# Altium schematic sheet 02-POWER.SchDoc
size C
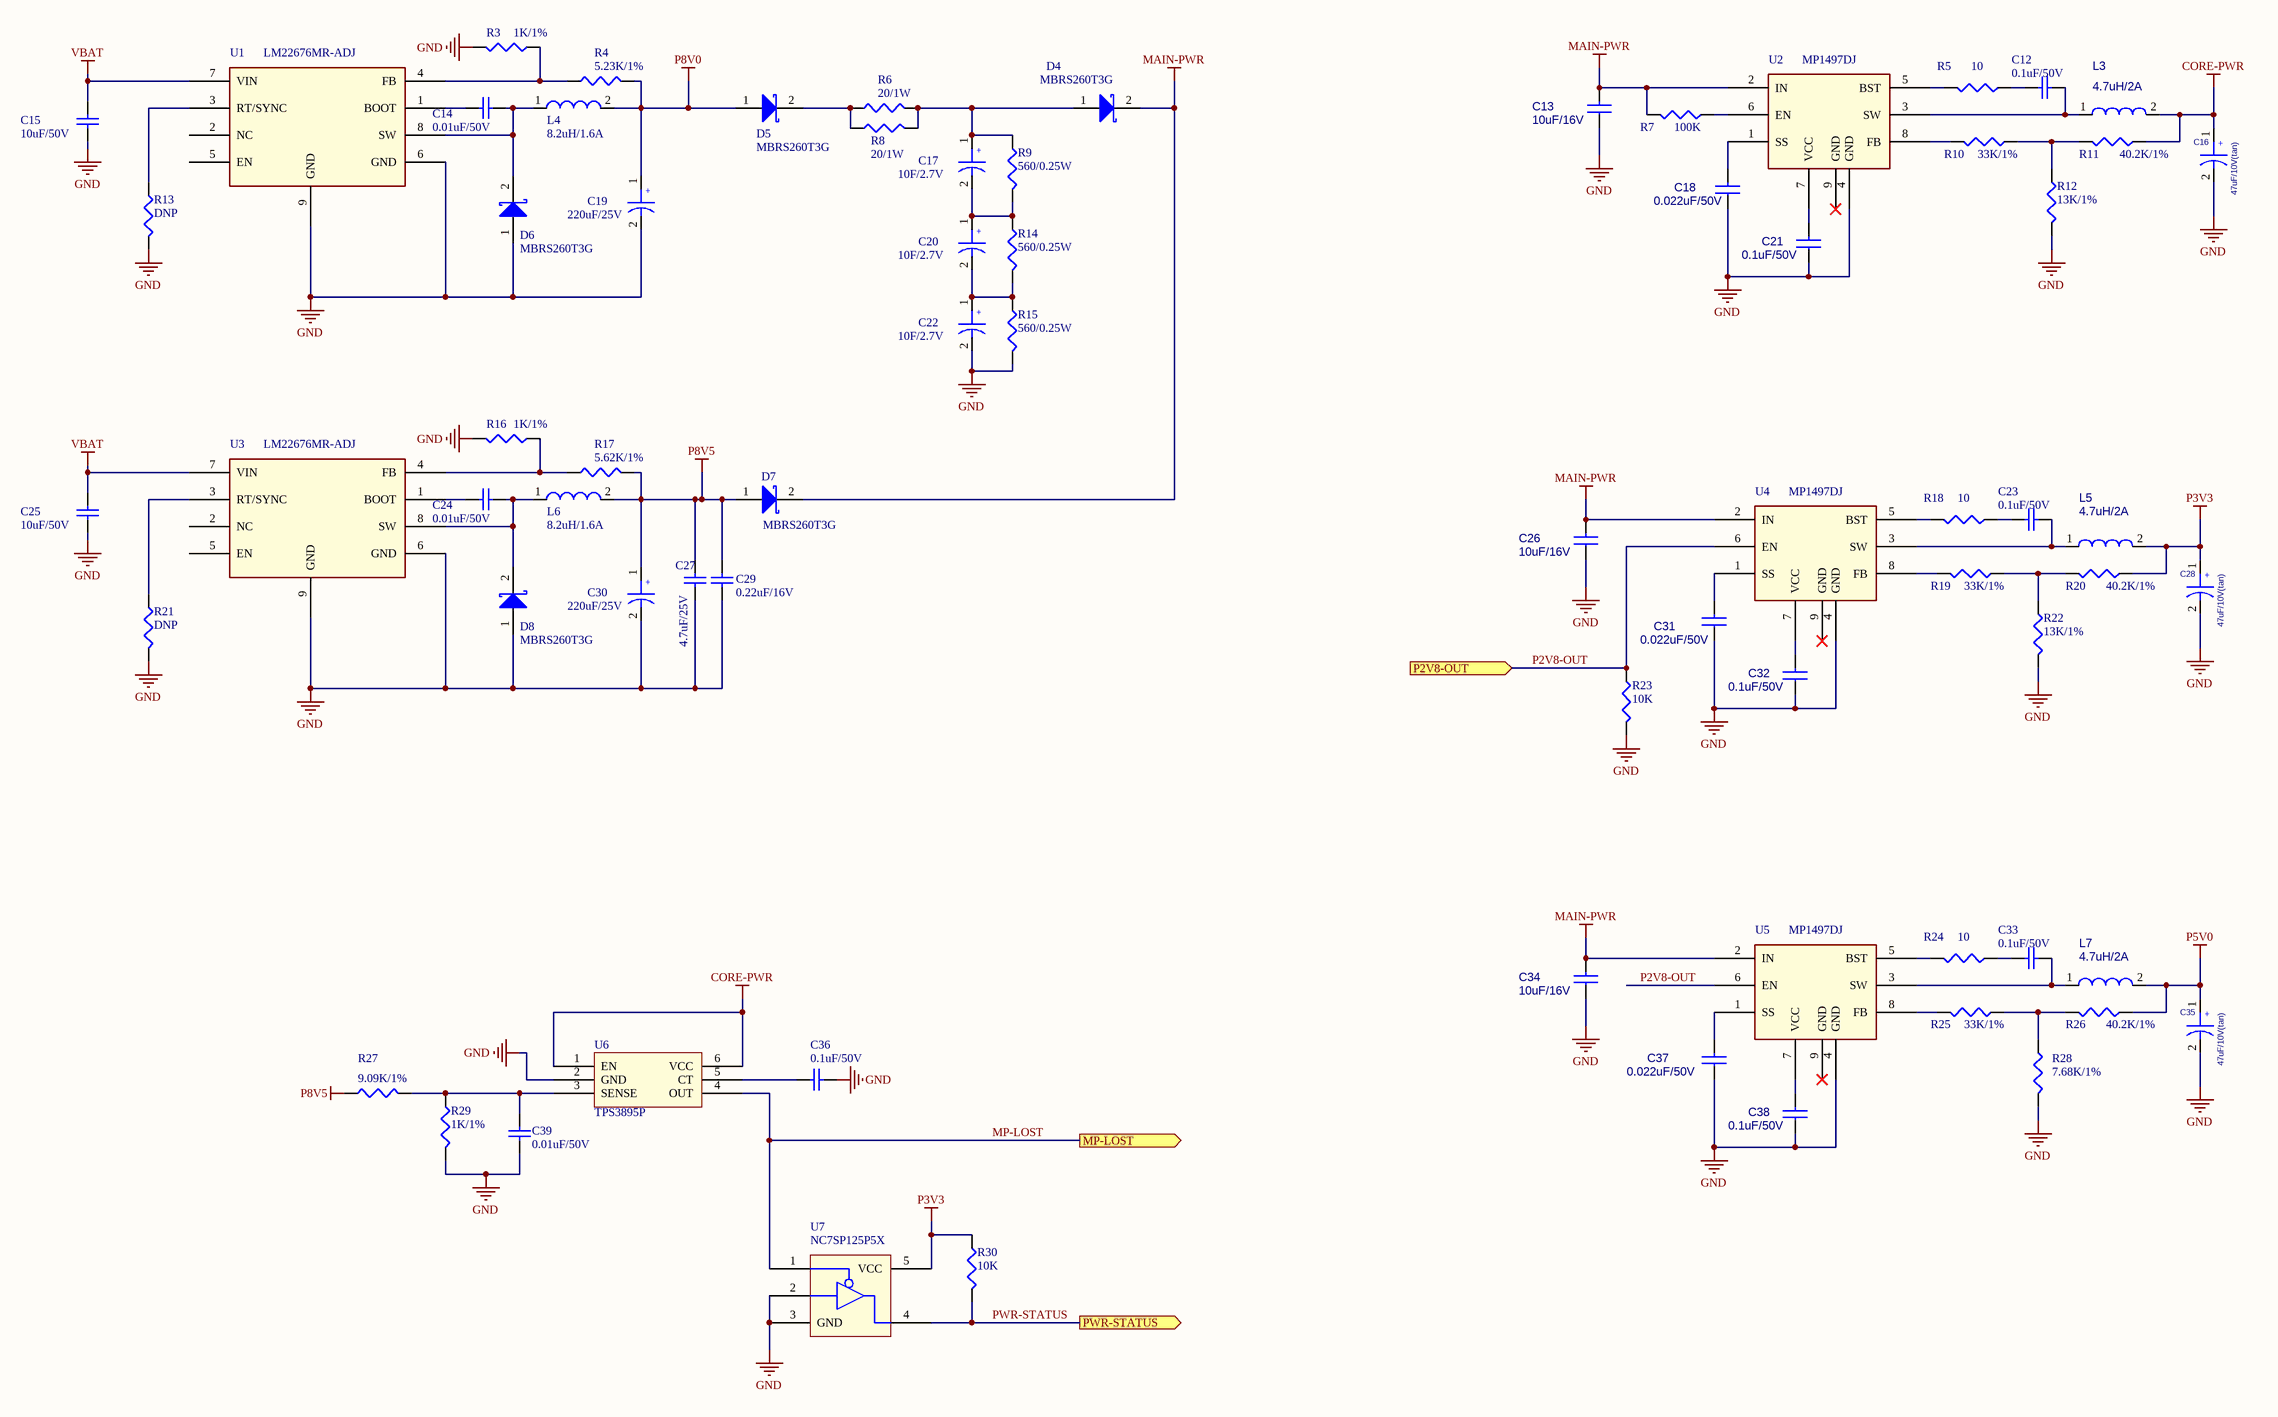
[diagram p0: 02-POWER.SchDoc]

## Parts
C12  0.1uF/50V  [0402]
C13  10uF/16V  [1206]
C14  0.01uF/50V  [0402]
C15  10uF/50V  [1210]
C16  47uF/10V(tan)  [3528]
C17  10F/2.7V  [SUPERCAP]
C18  0.022uF/50V  [0402]
C19  220uF/25V  [DL-8*10.5]
C20  10F/2.7V  [SUPERCAP]
C21  0.1uF/50V  [0402]
C22  10F/2.7V  [SUPERCAP]
C23  0.1uF/50V  [0402]
C24  0.01uF/50V  [0402]
C25  10uF/50V  [1210]
C26  10uF/16V  [1206]
C27  4.7uF/25V  [0805]
C28  47uF/10V(tan)  [3528]
C29  0.22uF/16V  [0402]
C30  220uF/25V  [DL-8*10.5]
C31  0.022uF/50V  [0402]
C32  0.1uF/50V  [0402]
C33  0.1uF/50V  [0402]
C34  10uF/16V  [1206]
C35  47uF/10V(tan)  [3528]
C36  0.1uF/50V  [0402]
C37  0.022uF/50V  [0402]
C38  0.1uF/50V  [0402]
C39  0.01uF/50V  [0402]
D4  MBRS260T3G  [SMB]
D5  MBRS260T3G  [SMB]
D6  MBRS260T3G  [SMB]
D7  MBRS260T3G  [SMB]
D8  MBRS260T3G  [SMB]
L3  4.7uH/2A  [IND-SMD-5.8*5.8]
L4  8.2uH/1.6A  [IND-SMD-5.8*5.8]
L5  4.7uH/2A  [IND-SMD-5.8*5.8]
L6  8.2uH/1.6A  [IND-SMD-5.8*5.8]
L7  4.7uH/2A  [IND-SMD-5.8*5.8]
R3  1K/1%  [0402]
R4  5.23K/1%  [0402]
R5  10  [0402]
R6  20/1W  [2512]
R7  100K  [0402]
R8  20/1W  [2512]
R9  560/0.25W  [1206]
R10  33K/1%  [0402]
R11  40.2K/1%  [0402]
R12  13K/1%  [0402]
R13  DNP  [0402]
R14  560/0.25W  [1206]
R15  560/0.25W  [1206]
R16  1K/1%  [0402]
R17  5.62K/1%  [0402]
R18  10  [0402]
R19  33K/1%  [0402]
R20  40.2K/1%  [0402]
R21  DNP  [0402]
R22  13K/1%  [0402]
R23  10K  [0402]
R24  10  [0402]
R25  33K/1%  [0402]
R26  40.2K/1%  [0402]
R27  9.09K/1%  [0402]
R28  7.68K/1%  [0402]
R29  1K/1%  [0402]
R30  10K  [0402]
U1  LM22676MR-ADJ  [PSO8]
U2  MP1497DJ  [TSOT23-8]
U3  LM22676MR-ADJ  [PSO8]
U4  MP1497DJ  [TSOT23-8]
U5  MP1497DJ  [TSOT23-8]
U6  TPS3895P  [SON]
U7  NC7SP125P5X  [SC70]

## Ports
MP-LOST (out), P2V8-OUT (in), PWR-STATUS (out)

## Nets
CORE-PWR: C16.1 L3.2 R11.1 U6.1(EN) U6.6(VCC)
GND: C13.1 C15.2 C16.2 C18.1 C19.2 C21.1 C22.2 C25.2 C26.1 C27.1 C28.2 C29.1 C30.2 C31.1 C32.1 C34.1 C35.2 C36.2 C37.1 C38.1 C39.2 D6.1(A) D8.1(A) R3.2 R12.2 R13.2 R15.2 R16.2 R21.2 R22.2 R23.2 R28.2 R29.2 U1.6(GND) U1.9(GND) U2.4(GND) U3.6(GND) U3.9(GND) U4.4(GND) U5.4(GND) U6.2(GND) U7.2(A) U7.3(GND)
MAIN-PWR: C13.2 C26.2 C34.2 D4.2(K) D7.2(K) R7.2 U2.2(IN) U4.2(IN) U5.2(IN)
P3V3: C28.1 L5.2 R20.1 R30.1 U7.5(VCC)
P5V0: C35.1 L7.2 R26.1
P8V0: C19.1 D5.1(A) L4.2 R4.2
P8V5: C27.2 C29.2 C30.1 D7.1(A) L6.2 R17.2 R27.1
VBAT: C15.1 C25.1 U1.7(VIN) U3.7(VIN)
MP-LOST: U6.4(OUT) U7.1(OE) ; port MP-LOST
P2V8-OUT: R23.1 U4.6(EN) U5.6(EN) ; port P2V8-OUT
PWR-STATUS: R30.2 U7.4(Y) ; port PWR-STATUS
NetC12_1: C12.1 L3.1 U2.3(SW)
NetC12_2: C12.2 R5.1
NetC14_1: C14.1 D6.2(K) L4.1 U1.8(SW)
NetC14_2: C14.2 U1.1(BOOT)
NetC17_1: C17.1 D4.1(A) R6.2 R8.2 R9.1
NetC17_2: C17.2 C20.1 R9.2 R14.1
NetC18_2: C18.2 U2.1(SS)
NetC20_2: C20.2 C22.1 R14.2 R15.1
NetC21_2: C21.2 U2.7(VCC)
NetC23_1: C23.1 L5.1 U4.3(SW)
NetC23_2: C23.2 R18.1
NetC24_1: C24.1 D8.2(K) L6.1 U3.8(SW)
NetC24_2: C24.2 U3.1(BOOT)
NetC31_2: C31.2 U4.1(SS)
NetC32_2: C32.2 U4.7(VCC)
NetC33_1: C33.1 L7.1 U5.3(SW)
NetC33_2: C33.2 R24.1
NetC36_1: C36.1 U6.5(CT)
NetC37_2: C37.2 U5.1(SS)
NetC38_2: C38.2 U5.7(VCC)
NetC39_1: C39.1 R27.2 R29.1 U6.3(SENSE)
NetD5_2: D5.2(K) R6.1 R8.1
NetR3_1: R3.1 R4.1 U1.4(FB)
NetR5_2: R5.2 U2.5(BST)
NetR7_1: R7.1 U2.6(EN)
NetR10_1: R10.1 R11.2 R12.1
NetR10_2: R10.2 U2.8(FB)
NetR13_1: R13.1 U1.3(RT/SYNC)
NetR16_1: R16.1 R17.1 U3.4(FB)
NetR18_2: R18.2 U4.5(BST)
NetR19_1: R19.1 R20.2 R22.1
NetR19_2: R19.2 U4.8(FB)
NetR21_1: R21.1 U3.3(RT/SYNC)
NetR24_2: R24.2 U5.5(BST)
NetR25_1: R25.1 R26.2 R28.1
NetR25_2: R25.2 U5.8(FB)

Not connected (* = marked no-connect by the designer): U1 2(NC) 5(EN); U2 9(GND)*; U3 2(NC) 5(EN); U4 9(GND)*; U5 9(GND)*

## Notes on the sheet
- (in symbol CAP WP) +

## Library data of the parts
C12 C15 C23 C25 C33 = Cap: Capacitor
  C15 C25: Published: 8-Jun-2000; LatestRevisionDate: 17-Jul-2002; LatestRevisionNote: Re-released for DXP Platform.; PackageReference: RAD-0.3; Publisher: Altium Limited; PackageDescription: Radial Cap, Thru-Hole; 2 Leads; 0.3 in Pin Spacing
C13 C18 C21 C26 C31 C32 C34 C37 C38 = CAP NP_Dup2
C14 C24 C27 C29 C36 C39 = Cap: Capacitor; Value: 0.1uF; Published: 8-Jun-2000; LatestRevisionDate: 17-Jul-2002; LatestRevisionNote: Re-released for DXP Platform.; PackageReference: RAD-0.3; Publisher: Altium Limited; PackageDescription: Radial Cap, Thru-Hole; 2 Leads; 0.3 in Pin Spacing
C16 C17 C19 C20 C22 C28 C30 C35 = CAP WP
D4-D8 = Diode 11DQ03: Schottky Rectifier
L3 L5 L7 = 4.7UH_CDH2D09BNP-4R7MC_0.7A_20%
L4 L6 = 4.7UH_CDH2D09BNP-4R7MC_0.7A_20%: Part Number: SH00000AJ00; ROOM: +1.3V_CORE
R3 R4 R6 R8 R9 R13-R17 R21 R27 R29 = Res3: Resistor; Value: 1K; Published: 8-Jun-2000; LatestRevisionDate: 29-May-2009; LatestRevisionNote: IPC-7351 Footprint Added.; PackageReference: J1-0603; Publisher: Altium Limited; PackageDescription: Chip Resistor
R5 R7 R10-R12 R18-R20 R22-R26 R28 R30 = CR16-1003FM
U1 U3 = LM22670_0
U2 U4 U5 = MP1482_5
U6 = TPS3896